# Altium schematic sheet A4_INSAGE_03.SchDoc: AOPs
size A4; Author: INSA GE; Organization: INSA de Lyon; Address1: Département Génie Électrique; Address2: Bâtiment Gustave Ferrié; Address3: 8, Rue de la Physique; Address4: 69621 VILLEURBANNE CEDEX; Revision: 0; SheetNumber: 3; SheetTotal: 3
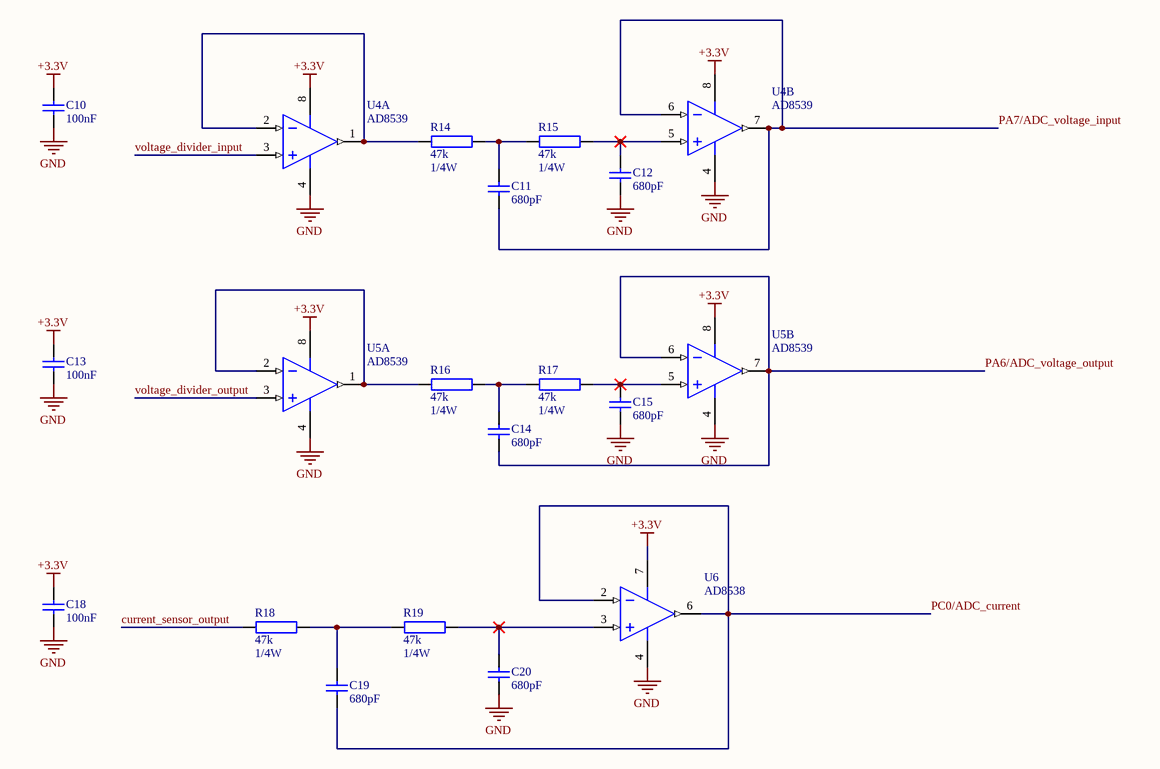
[diagram p0: A4_INSAGE_03.SchDoc]

## Parts
C10  value 100nF  [1206_C]  (hidden comment: Condensateur NON pol)
C11  value 680pF  [1206_C]  (hidden comment: Condensateur NON pol)
C12  value 680pF  [1206_C]  (hidden comment: Condensateur NON pol)
C13  value 100nF  [1206_C]  (hidden comment: Condensateur NON pol)
C14  value 680pF  [1206_C]  (hidden comment: Condensateur NON pol)
C15  value 680pF  [1206_C]  (hidden comment: Condensateur NON pol)
C18  value 100nF  [1206_C]  (hidden comment: Condensateur NON pol)
C19  value 680pF  [1206_C]  (hidden comment: Condensateur NON pol)
C20  value 680pF  [1206_C]  (hidden comment: Condensateur NON pol)
R14  value 47k  Puissance: 1/4W  [1206_R]  (hidden comment: Resistance)
R15  value 47k  Puissance: 1/4W  [1206_R]  (hidden comment: Resistance)
R16  value 47k  Puissance: 1/4W  [1206_R]  (hidden comment: Resistance)
R17  value 47k  Puissance: 1/4W  [1206_R]  (hidden comment: Resistance)
R18  value 47k  Puissance: 1/4W  [1206_R]  (hidden comment: Resistance)
R19  value 47k  Puissance: 1/4W  [1206_R]  (hidden comment: Resistance)
U4  AD8539  [SOIC-8-150]  (parts A,B of 2)
U5  AD8539  [SOIC-8-150]  (parts A,B of 2)
U6  AD8538  [SOIC-8-150]

## Nets
+3.3V: C10.2 C13.2 C18.2 U4.8(+V) U5.8(+V) U6.7(+V)
GND: C10.1 C12.1 C13.1 C15.1 C18.1 C20.1 U4.4(-V) U5.4(-V) U6.4(-V)
current_sensor_output: R18.1
PA6/ADC_voltage_output: C14.1 U5.6(-IN_B) U5.7(OUT_B)
PA7/ADC_voltage_input: C11.1 U4.6(-IN_B) U4.7(OUT_B)
PC0/ADC_current: C19.1 U6.2(-IN) U6.6(OUT)
voltage_divider_input: U4.3(+IN_A)
voltage_divider_output: U5.3(+IN_A)
NetC11_2: C11.2 R14.2 R15.1
NetC12_2: C12.2 R15.2 U4.5(+IN_B)
NetC14_2: C14.2 R16.2 R17.1
NetC15_2: C15.2 R17.2 U5.5(+IN_B)
NetC19_2: C19.2 R18.2 R19.1
NetC20_2: C20.2 R19.2 U6.3(+IN)
NetR14_1: R14.1 U4.1(OUT_A) U4.2(-IN_A)
NetR16_1: R16.1 U5.1(OUT_A) U5.2(-IN_A)

## Notes on the sheet
- Format :
- Date :
- A4
- Auteur :
- Page
- sur
- Révision :
- Projet :
- Fichier :
- INSA de Lyon
- Département Génie Electrique
- 8, rue de la Physique
- 69621 VILLEURBANNE CEDEX
- Nom de la feuille :

## Library data of the parts
R14-R19 = Resistance: Resistor; Published: 8-Jun-2000; LatestRevisionDate: 29-May-2009; LatestRevisionNote: IPC-7351 Footprint Added.; PackageReference: J1-0603; Publisher: Altium Limited; PackageDescription: Chip Resistor
U4 U5 = AD8539: Double Channel Single-Supply Operation Operational Amplifier, 430 KHz BW, 400 mV/us SR, Industrial, 8-pin SOIC (R-8), Reel; Manufacturer: Analog Devices; PartNumber: AD8539ARZ-REEL; V Span Min: 2.7V; V Span Max: 5.5V; Input Offset Voltage: 5uV; Iq/Amp: 210uA; Amplifiers Per Package: 2; Small Signal Bandwidth: 430KHz; Input Bias Current: 15pA; PackageReference: R-8; ComponentLink3URL: http://www.analog.com/static/imported-files/packages/PKG_PDF/SOIC_Narrow%20(R)/R_8.pdf; PackageVersion: 060506-A; ComponentLink1Description: Manufacturer URL; Code_JEDEC: MS-012-AA; Generic Part Number: AD8539; ComponentLink3Description: Package Specification; DatasheetVersion: Rev. A; PackageDescription: 8-Pin Standard Small Outline Package, Body 3.9 x 4.9 mm, Pitch 1.27 mm; ComponentLink2URL: http://www.analog.com/static/imported-files/data_sheets/AD8538_8539.pdf; Slew Rate: 400mV/us; ComponentLink2Description: Datasheet; ComponentLink1URL: http://www.analog.com/en/index.html; Mounting Technology: Surface Mount
U6 = AD8538: Op Amp Single Precision Amplifier R-R I/O ±2.5V/5V 8-Pin SOIC N Tube; Generic Part Number: AD8539; Manufacturer: Analog Devices; PartNumber: AD8539ARZ-REEL; V Span Min: 2.7V; V Span Max: 5.5V; Input Offset Voltage: 5uV; Iq/Amp: 210uA; Amplifiers Per Package: 2; Slew Rate: 400mV/us; Small Signal Bandwidth: 430KHz; Input Bias Current: 15pA; PackageReference: R-8; ComponentLink3URL: http://www.analog.com/static/imported-files/packages/PKG_PDF/SOIC_Narrow%20(R)/R_8.pdf; PackageVersion: 060506-A; ComponentLink1Description: Manufacturer URL; Code_JEDEC: MS-012-AA; ComponentLink3Description: Package Specification; DatasheetVersion: Rev. A; PackageDescription: 8-Pin Standard Small Outline Package, Body 3.9 x 4.9 mm, Pitch 1.27 mm; ComponentLink2URL: http://www.analog.com/static/imported-files/data_sheets/AD8538_8539.pdf; ComponentLink2Description: Datasheet; ComponentLink1URL: http://www.analog.com/en/index.html; Mounting Technology: Surface Mount
C10-C15 C18-C20 = Condensateur NON pol: Published: 8-Jun-2000; LatestRevisionDate: 29-May-2009; LatestRevisionNote: IPC-7351 Footprint Added.; PackageReference: C1206; Publisher: Altium Limited; PackageDescription: Chip Capacitor